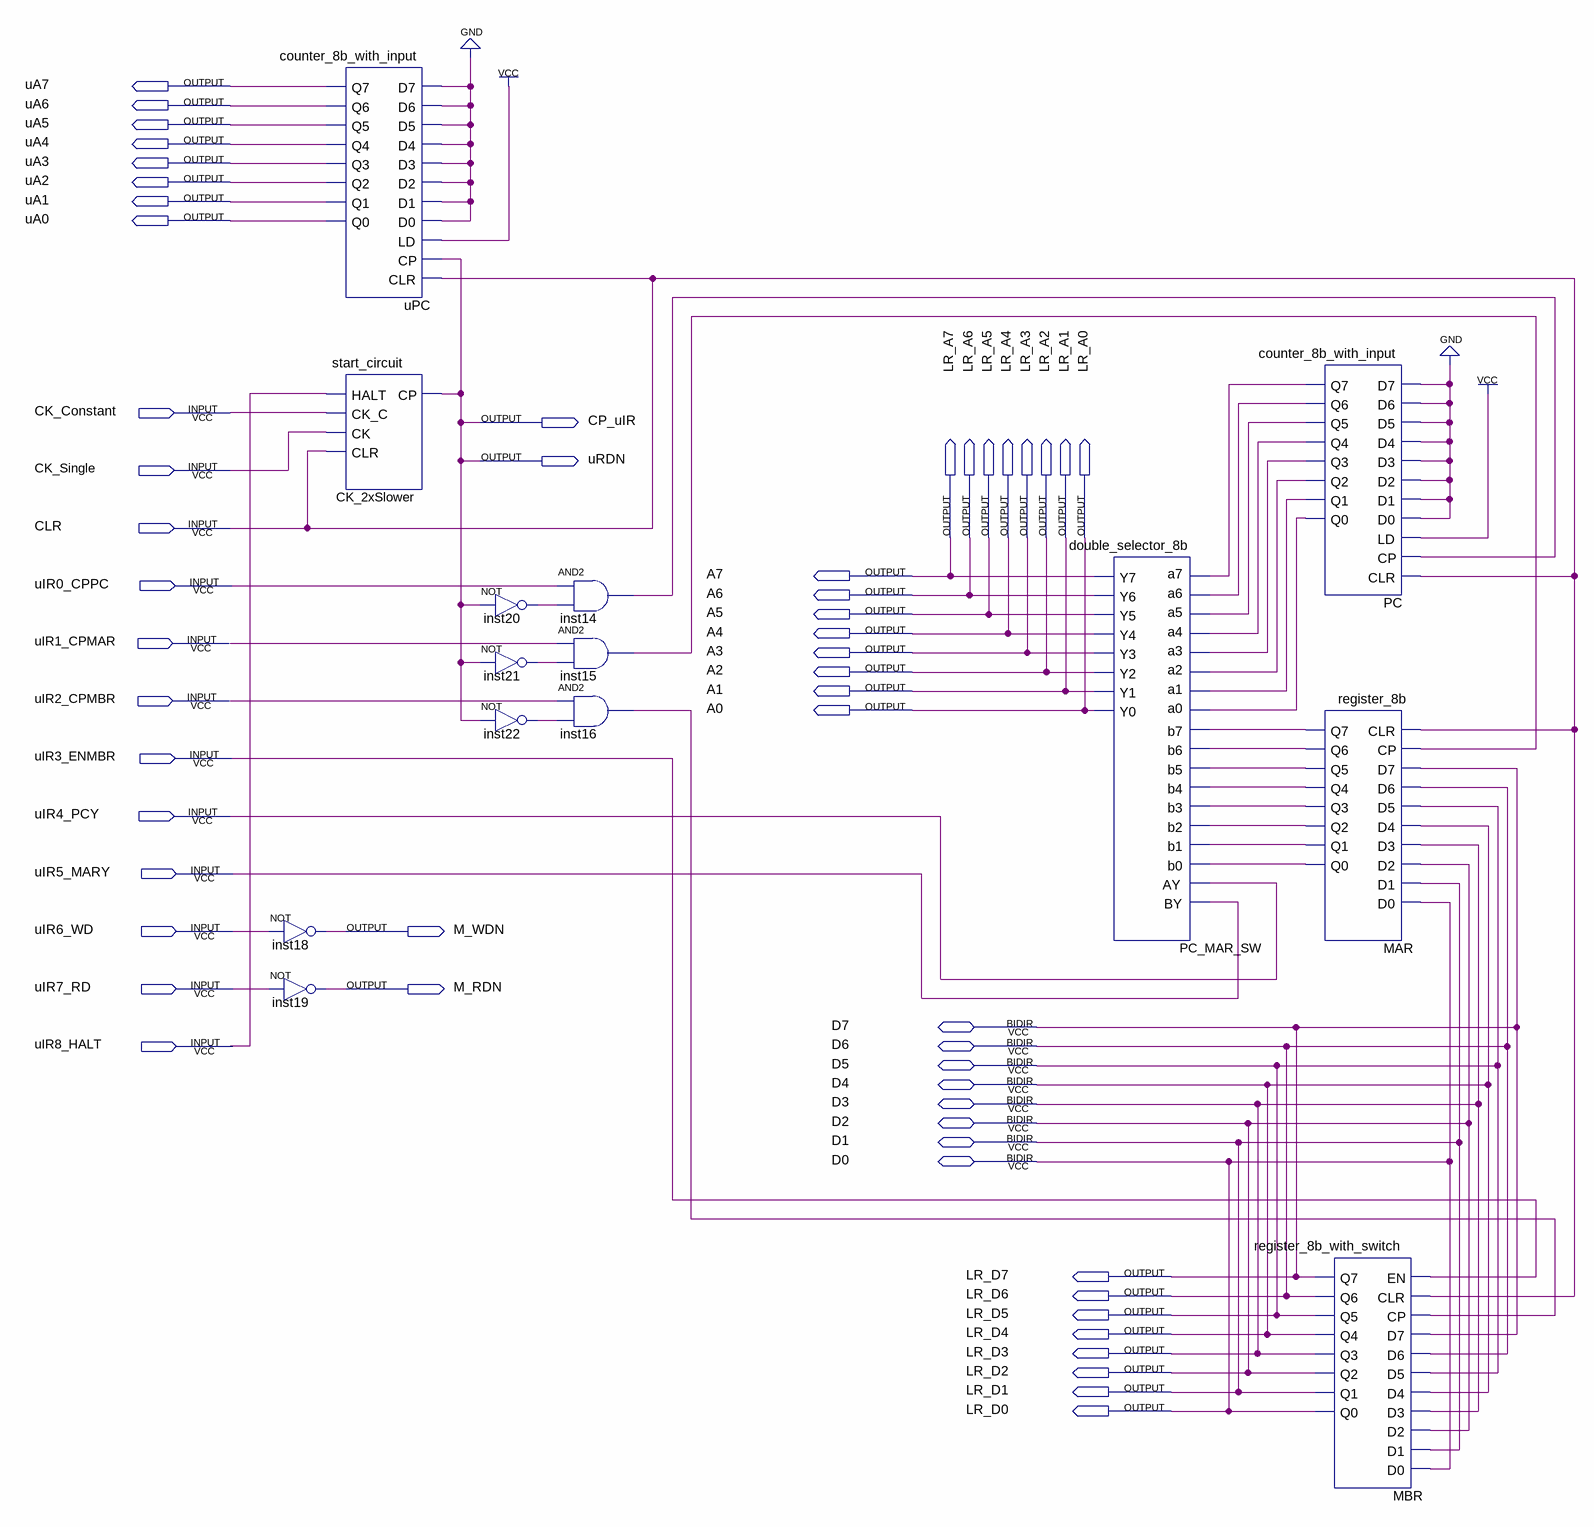
[diagram p0: schematic sheet]
// Quartus schematic microprogram_ram.bdf as structural Verilog: 14 symbols, 56 pins
module microprogram_ram (
  input  CK_Constant,
  input  CK_Single,
  input  CLR,
  input  uIR0_CPPC,
  input  uIR1_CPMAR,
  input  uIR2_CPMBR,
  input  uIR3_ENMBR,
  input  uIR4_PCY,
  input  uIR5_MARY,
  input  uIR6_WD,
  input  uIR7_RD,
  input  uIR8_HALT,
  inout  D7,
  inout  D6,
  inout  D5,
  inout  D4,
  inout  D3,
  inout  D2,
  inout  D1,
  inout  D0,
  output uA7,
  output uA6,
  output uA5,
  output uA4,
  output uA3,
  output uA2,
  output uA1,
  output uA0,
  output CP_uIR,
  output uRDN,
  output LR_A7,
  output LR_A6,
  output LR_A5,
  output LR_A4,
  output LR_A3,
  output LR_A2,
  output LR_A1,
  output LR_A0,
  output A7,
  output A6,
  output A5,
  output A4,
  output A3,
  output A2,
  output A1,
  output A0,
  output M_WDN,
  output M_RDN,
  output LR_D7,
  output LR_D6,
  output LR_D5,
  output LR_D4,
  output LR_D3,
  output LR_D2,
  output LR_D1,
  output LR_D0
);

  wire inst14_out, inst15_out, inst16_out, inst20_out, inst21_out, inst22_out, MAR_q0, MAR_q1, MAR_q2,
       MAR_q3, MAR_q4, MAR_q5, MAR_q6, MAR_q7, PC_q0, PC_q1, PC_q2, PC_q3, PC_q4, PC_q5, PC_q6, PC_q7;

  not inst18 (M_WDN, uIR6_WD);
  not inst19 (M_RDN, uIR7_RD);
  counter_8b_with_input uPC (
    .D7(1'b0), .D6(1'b0), .D5(1'b0), .D4(1'b0), .D3(1'b0), .D2(1'b0), .D1(1'b0), .D0(1'b0), .LD(1'b1),
    .CP(CP_uIR), .CLR(CLR), .Q7(uA7), .Q6(uA6), .Q5(uA5), .Q4(uA4), .Q3(uA3), .Q2(uA2), .Q1(uA1), .Q0(uA0));
  start_circuit CK_2xSlower (.HALT(uIR8_HALT), .CK_C(CK_Constant), .CK(CK_Single), .CLR(CLR), .CP(CP_uIR));
  not inst20 (inst20_out, CP_uIR);
  not inst21 (inst21_out, CP_uIR);
  not inst22 (inst22_out, CP_uIR);
  and inst14 (inst14_out, uIR0_CPPC, inst20_out);
  and inst15 (inst15_out, uIR1_CPMAR, inst21_out);
  and inst16 (inst16_out, uIR2_CPMBR, inst22_out);
  double_selector_8b PC_MAR_SW (
    .a0(PC_q0), .a1(PC_q1), .a2(PC_q2), .a3(PC_q3), .a4(PC_q4), .a5(PC_q5), .a6(PC_q6), .a7(PC_q7),
    .b0(MAR_q0), .b1(MAR_q1), .b2(MAR_q2), .b3(MAR_q3), .b4(MAR_q4), .b5(MAR_q5), .b6(MAR_q6), .b7(MAR_q7),
    .AY(uIR4_PCY), .BY(uIR5_MARY), .Y0(A0), .Y1(A1), .Y2(A2), .Y3(A3), .Y4(A4), .Y5(A5), .Y6(A6), .Y7(A7));
  counter_8b_with_input PC (
    .D7(1'b0), .D6(1'b0), .D5(1'b0), .D4(1'b0), .D3(1'b0), .D2(1'b0), .D1(1'b0), .D0(1'b0), .LD(1'b1),
    .CP(inst14_out), .CLR(CLR), .Q7(PC_q7), .Q6(PC_q6), .Q5(PC_q5), .Q4(PC_q4), .Q3(PC_q3), .Q2(PC_q2),
    .Q1(PC_q1), .Q0(PC_q0));
  register_8b MAR (
    .CLR(CLR), .CP(inst15_out), .D7(D7), .D6(D6), .D5(D5), .D4(D4), .D3(D3), .D2(D2), .D1(D1), .D0(D0),
    .Q7(MAR_q7), .Q6(MAR_q6), .Q5(MAR_q5), .Q4(MAR_q4), .Q3(MAR_q3), .Q2(MAR_q2), .Q1(MAR_q1), .Q0(MAR_q0));
  register_8b_with_switch MBR (
    .EN(uIR3_ENMBR), .CLR(CLR), .CP(inst16_out), .D7(D7), .D6(D6), .D5(D5), .D4(D4), .D3(D3), .D2(D2),
    .D1(D1), .D0(D0), .Q7(D7), .Q6(D6), .Q5(D5), .Q4(D4), .Q3(D3), .Q2(D2), .Q1(D1), .Q0(D0));

  assign LR_A0 = A0;
  assign LR_A1 = A1;
  assign LR_A2 = A2;
  assign LR_A3 = A3;
  assign LR_A4 = A4;
  assign LR_A5 = A5;
  assign LR_A6 = A6;
  assign LR_A7 = A7;
  assign LR_D0 = D0;
  assign LR_D1 = D1;
  assign LR_D2 = D2;
  assign LR_D3 = D3;
  assign LR_D4 = D4;
  assign LR_D5 = D5;
  assign LR_D6 = D6;
  assign LR_D7 = D7;
  assign uRDN = CP_uIR;
endmodule
